# EAGLE schematic zx80_build034.routed (EAGLE 7.5.0)

## Sheet 1 of 3
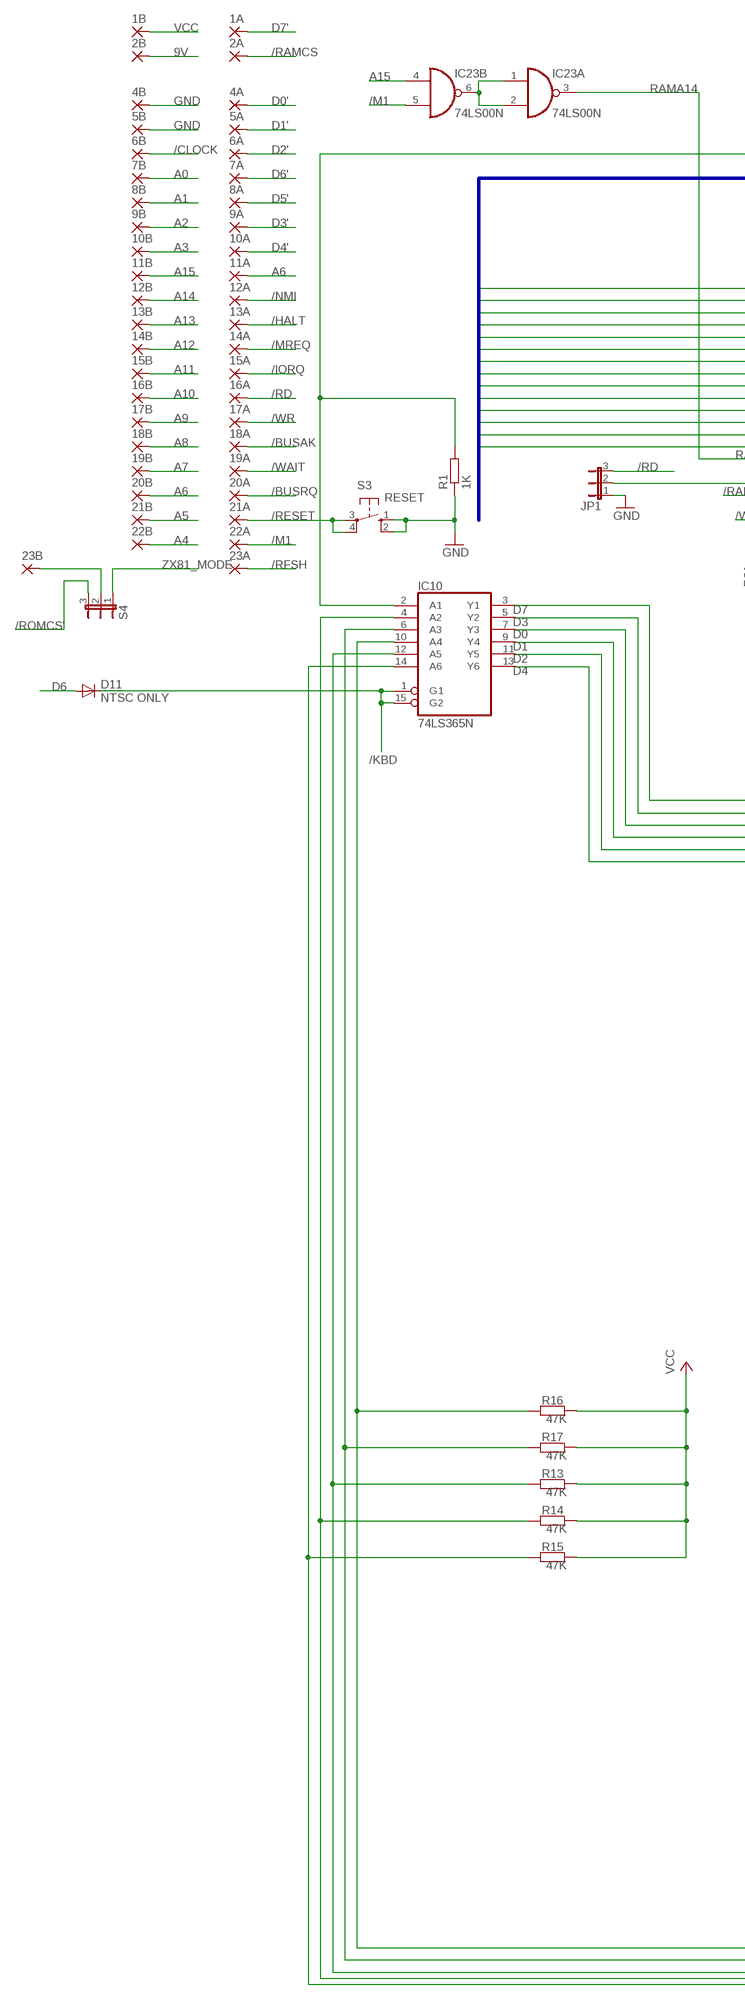
[diagram p0: schematic, sheet 1, part 1 of 2]
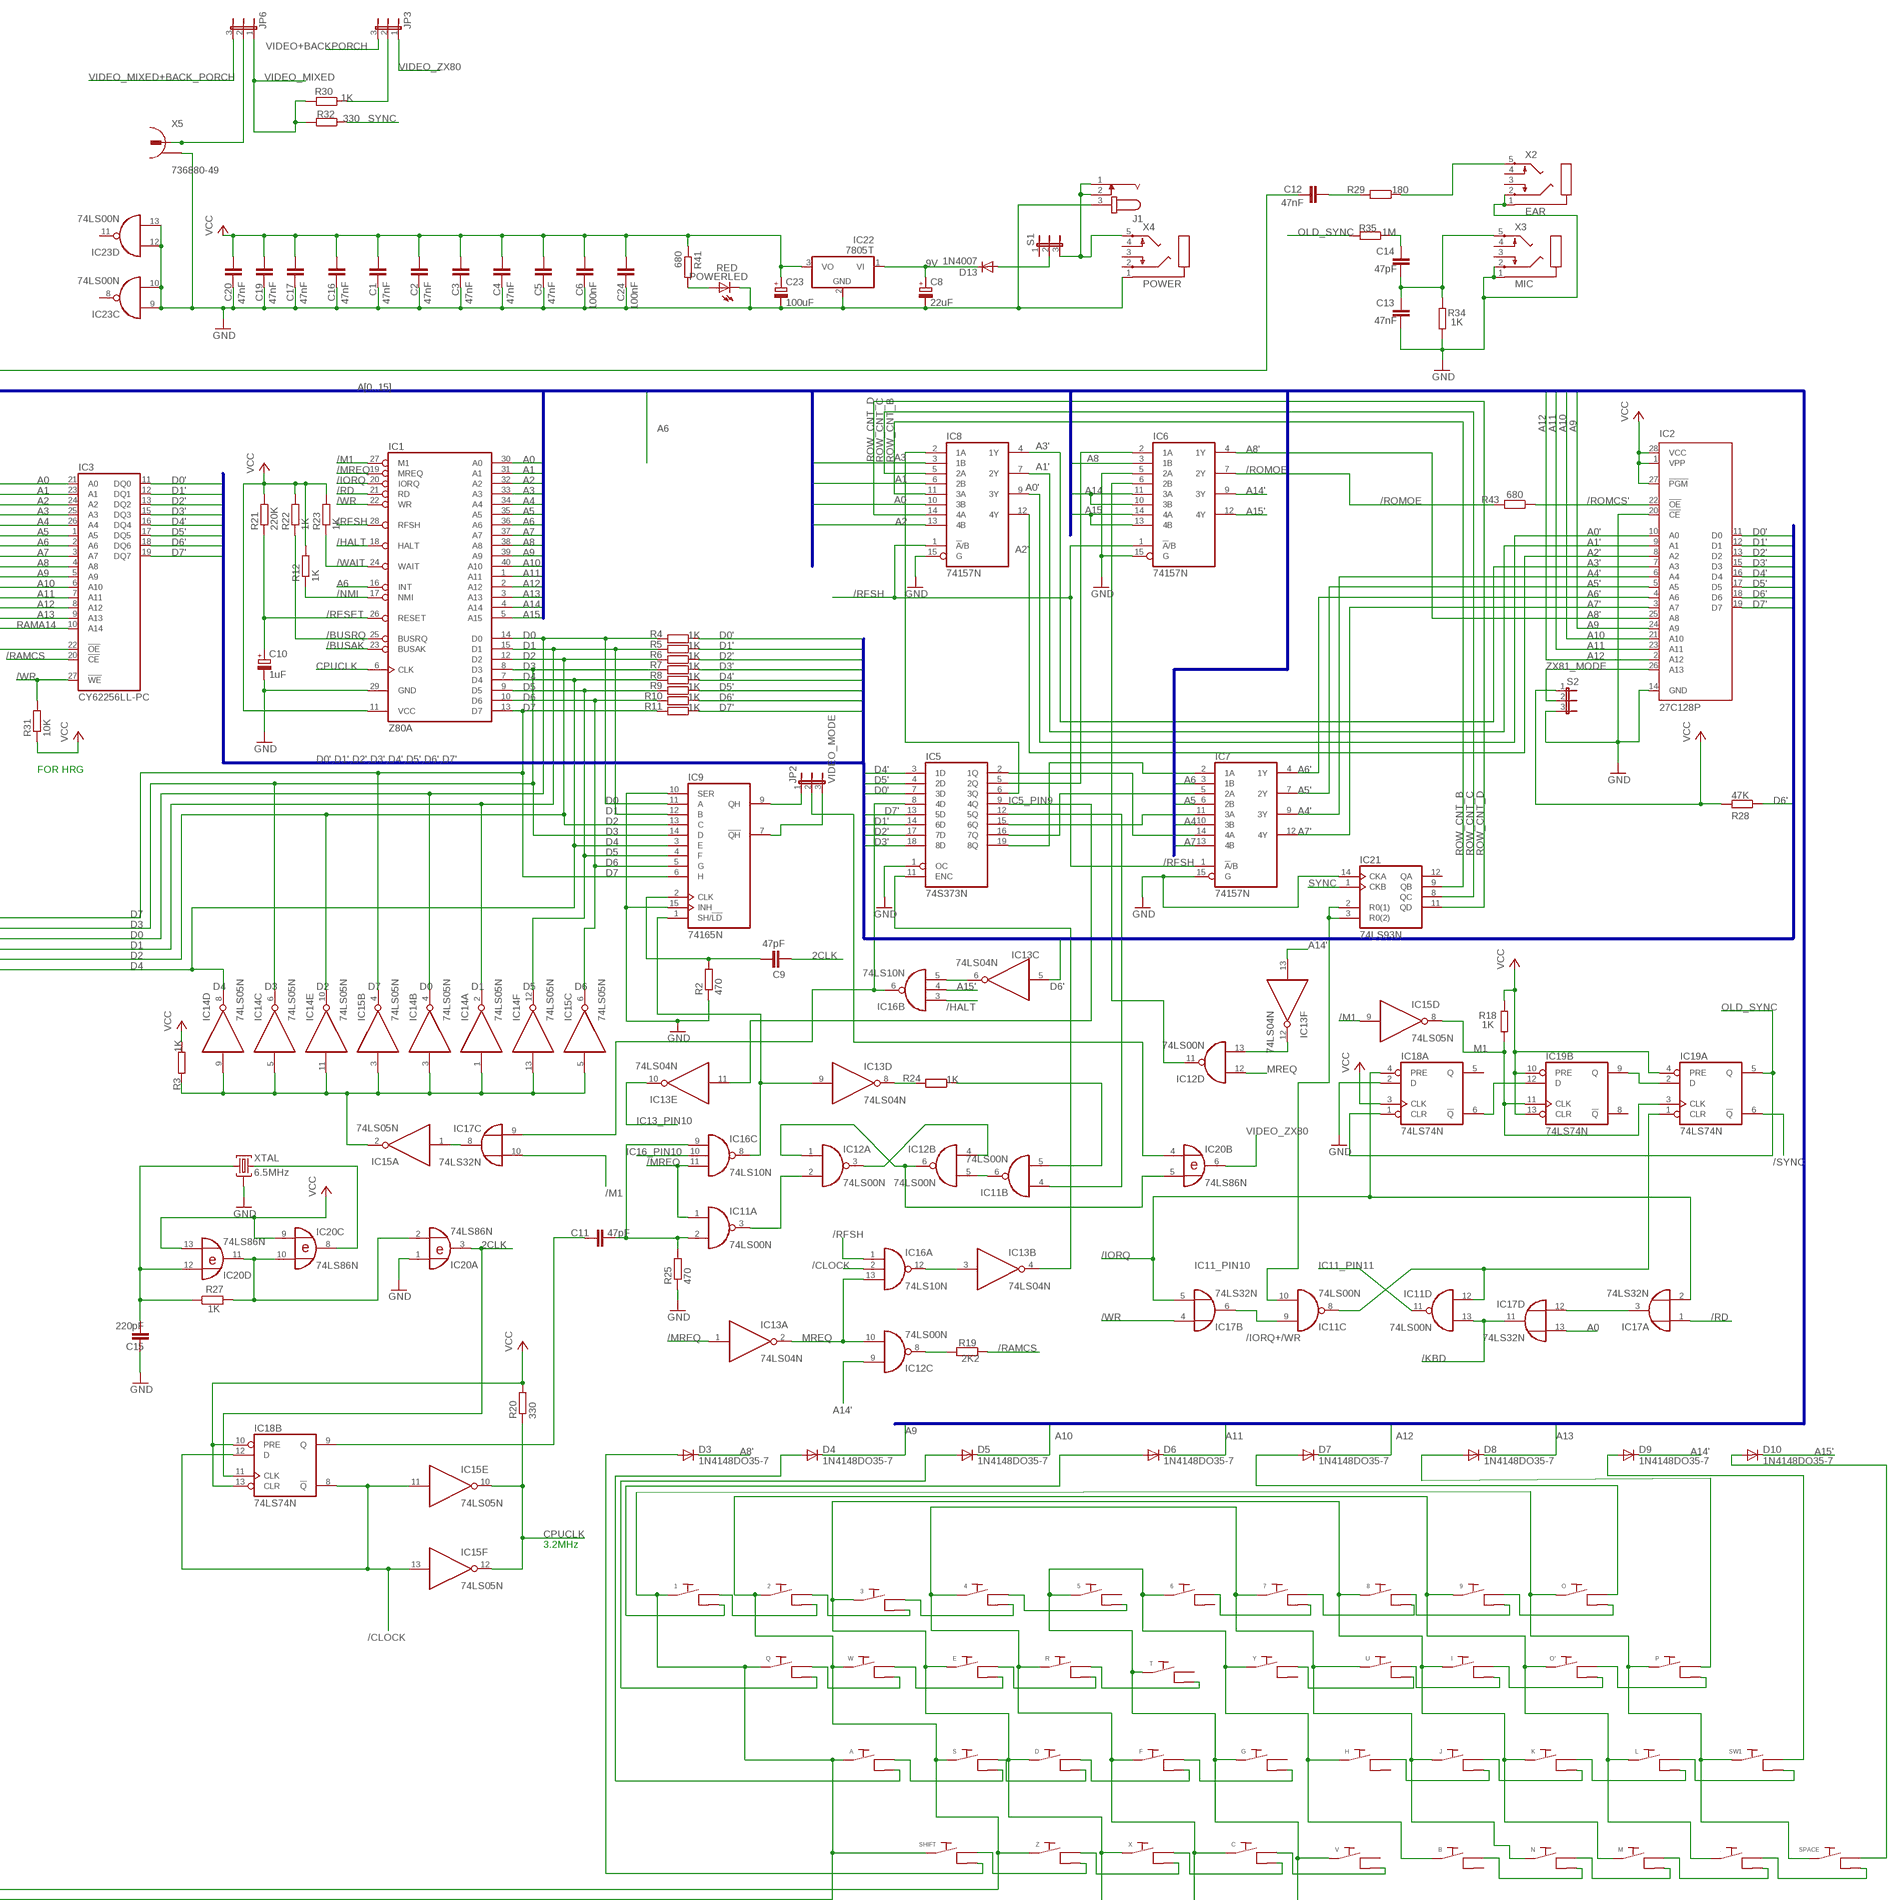
[diagram p1: schematic, sheet 1, part 2 of 2]

### Parts
1  TA_DK  [TA_DK]
1A  SMD2EDGEPIN  [EDGEPIN]
1B  SMD2EDGEPIN  [EDGEPIN]
2  TA_DK  [TA_DK]
2A  SMD2EDGEPIN  [EDGEPIN]
2B  SMD2EDGEPIN  [EDGEPIN]
3  TA_DK  [TA_DK]
4  TA_DK  [TA_DK]
4A  SMD2EDGEPIN  [EDGEPIN]
4B  SMD2EDGEPIN  [EDGEPIN]
5  TA_DK  [TA_DK]
5A  SMD2EDGEPIN  [EDGEPIN]
5B  SMD2EDGEPIN  [EDGEPIN]
6  TA_DK  [TA_DK]
6A  SMD2EDGEPIN  [EDGEPIN]
6B  SMD2EDGEPIN  [EDGEPIN]
7  TA_DK  [TA_DK]
7A  SMD2EDGEPIN  [EDGEPIN]
7B  SMD2EDGEPIN  [EDGEPIN]
8  TA_DK  [TA_DK]
8A  SMD2EDGEPIN  [EDGEPIN]
8B  SMD2EDGEPIN  [EDGEPIN]
9  TA_DK  [TA_DK]
9A  SMD2EDGEPIN  [EDGEPIN]
9B  SMD2EDGEPIN  [EDGEPIN]
10A  SMD2EDGEPIN  [EDGEPIN]
10B  SMD2EDGEPIN  [EDGEPIN]
11A  SMD2EDGEPIN  [EDGEPIN]
11B  SMD2EDGEPIN  [EDGEPIN]
12A  SMD2EDGEPIN  [EDGEPIN]
12B  SMD2EDGEPIN  [EDGEPIN]
13A  SMD2EDGEPIN  [EDGEPIN]
13B  SMD2EDGEPIN  [EDGEPIN]
14A  SMD2EDGEPIN  [EDGEPIN]
14B  SMD2EDGEPIN  [EDGEPIN]
15A  SMD2EDGEPIN  [EDGEPIN]
15B  SMD2EDGEPIN  [EDGEPIN]
16A  SMD2EDGEPIN  [EDGEPIN]
16B  SMD2EDGEPIN  [EDGEPIN]
17A  SMD2EDGEPIN  [EDGEPIN]
17B  SMD2EDGEPIN  [EDGEPIN]
18A  SMD2EDGEPIN  [EDGEPIN]
18B  SMD2EDGEPIN  [EDGEPIN]
19A  SMD2EDGEPIN  [EDGEPIN]
19B  SMD2EDGEPIN  [EDGEPIN]
20A  SMD2EDGEPIN  [EDGEPIN]
20B  SMD2EDGEPIN  [EDGEPIN]
21A  SMD2EDGEPIN  [EDGEPIN]
21B  SMD2EDGEPIN  [EDGEPIN]
22A  SMD2EDGEPIN  [EDGEPIN]
22B  SMD2EDGEPIN  [EDGEPIN]
23A  SMD2EDGEPIN  [EDGEPIN]
23B  SMD2EDGEPIN  [EDGEPIN]
.  TA_DK  [TA_DK]
A  TA_DK  [TA_DK]
B  TA_DK  [TA_DK]
C  TA_DK  [TA_DK]
C1  47nF  C-EU025-024X044  [C025-024X044]
C2  47nF  C-EU025-024X044  [C025-024X044]
C3  47nF  C-EU025-024X044  [C025-024X044]
C4  47nF  C-EU025-024X044  [C025-024X044]
C5  47nF  C-EU025-024X044  [C025-024X044]
C6  100nF  C-EU025-024X044  [C025-024X044]
C8  22uF  CPOL-EUE2.5-5  [E2,5-5]
C9  47pF  C-EU050-024X044  [C050-024X044]
C10  1uF  CPOL-EUE2.5-5  [E2,5-5]
C11  47pF  C-EU025-024X044  [C025-024X044]
C12  47nF  C-EU025-024X044  [C025-024X044]
C13  47nF  C-EU025-024X044  [C025-024X044]
C14  47pF  C-EU025-024X044  [C025-024X044]
C15  220pF  C-EU025-024X044  [C025-024X044]
C16  47nF  C-EU025-024X044  [C025-024X044]
C17  47nF  C-EU025-024X044  [C025-024X044]
C19  47nF  C-EU025-024X044  [C025-024X044]
C20  47nF  C-EU025-024X044  [C025-024X044]
C23  100uF  CPOL-EUE2.5-5  [E2,5-5]
C24  100nF  C-EU050-025X075  [C050-025X075]
D  TA_DK  [TA_DK]
D3  1N4148DO35-7  [DO35-7]
D4  1N4148DO35-7  [DO35-7]
D5  1N4148DO35-7  [DO35-7]
D6  1N4148DO35-7  [DO35-7]
D7  1N4148DO35-7  [DO35-7]
D8  1N4148DO35-7  [DO35-7]
D9  1N4148DO35-7  [DO35-7]
D10  1N4148DO35-7  [DO35-7]
D11  NTSC ONLY  1N4148DO35-7  [DO35-7]
D13  1N4007  1N4942  [DO41-10]
E  TA_DK  [TA_DK]
F  TA_DK  [TA_DK]
G  TA_DK  [TA_DK]
H  TA_DK  [TA_DK]
I  TA_DK  [TA_DK]
IC1  Z80A  Z80CPU  [DIL40]
IC2  27C128P  [DIL28-6]
IC3  CY62256LL-PC  [DIL28-6]
IC5  74S373N  [DIL20]
IC6  74157N  [DIL16]
IC7  74157N  [DIL16]
IC8  74157N  [DIL16]
IC9  74165N  [DIL16]
IC10  74LS365N  [DIL16]
IC11  74LS00N  [DIL14]
IC12  74LS00N  [DIL14]
IC13  74LS04N  [DIL14]
IC14  74LS05N  [DIL14]
IC15  74LS05N  [DIL14]
IC16  74LS10N  [DIL14]
IC17  74LS32N  [DIL14]
IC18  74LS74N  [DIL14]
IC19  74LS74N  [DIL14]
IC20  74LS86N  [DIL14]
IC21  74LS93N  [DIL14]
IC22  7805T  [TO220H]
IC23  74LS00N  [DIL14]
J  TA_DK  [TA_DK]
J1  JACK-PLUG0  [SPC4077]
JP1  JP2E  [JP2]
JP2  VIDEO_MODE  JP2E  [JP2]
JP3  JP2E  [JP2]
JP6  JP2E  [JP2]
K  TA_DK  [TA_DK]
L  TA_DK  [TA_DK]
M  TA_DK  [TA_DK]
N  TA_DK  [TA_DK]
O  TA_DK  [TA_DK]
O'  TA_DK  [TA_DK]
P  TA_DK  [TA_DK]
POWERLED  RED  LED3MM  [LED3MM]
Q  TA_DK  [TA_DK]
R  TA_DK  [TA_DK]
R1  1K  R-EU_0204/7  [0204/7]
R2  470  R-EU_0204/7  [0204/7]
R3  1K  R-EU_0204/7  [0204/7]
R4  1K  R-EU_0204/7  [0204/7]
R5  1K  R-EU_0204/7  [0204/7]
R6  1K  R-EU_0204/7  [0204/7]
R7  1K  R-EU_0204/7  [0204/7]
R8  1K  R-EU_0204/7  [0204/7]
R9  1K  R-EU_0204/7  [0204/7]
R10  1K  R-EU_0204/7  [0204/7]
R11  1K  R-EU_0204/7  [0204/7]
R12  1K  R-EU_0204/7  [0204/7]
R13  47K  R-EU_0204/7  [0204/7]
R14  47K  R-EU_0204/7  [0204/7]
R15  47K  R-EU_0204/7  [0204/7]
R16  47K  R-EU_0204/7  [0204/7]
R17  47K  R-EU_0204/7  [0204/7]
R18  1K  R-EU_0204/7  [0204/7]
R19  2K2  R-EU_0204/7  [0204/7]
R20  330  R-EU_0204/7  [0204/7]
R21  220K  R-EU_0204/7  [0204/7]
R22  1K  R-EU_0204/7  [0204/7]
R23  1K  R-EU_0204/7  [0204/7]
R24  1K  R-EU_0204/7  [0204/7]
R25  470  R-EU_0204/7  [0204/7]
R27  1K  R-EU_0204/7  [0204/7]
R28  47K  R-EU_0204/7  [0204/7]
R29  180  R-EU_0204/7  [0204/7]
R30  1K  R-EU_0204/7  [0204/7]
R31  10K  R-EU_0204/7  [0204/7]
R32  330  R-EU_0204/7  [0204/7]
R34  1K  R-EU_0204/7  [0204/7]
R35  1M  R-EU_0204/7  [0204/7]
R41  680  R-EU_0204/7  [0204/7]
R43  680  R-EU_0204/7  [0204/7]
S  TA_DK  [TA_DK]
S1  JP2E  [JP2]
S2  JP2E  [JP2]
S3  RESET  10-XX  [B3F-10XX]
S4  JP2E  [JP2]
SHIFT  TA_DK  [TA_DK]
SPACE  TA_DK  [TA_DK]
SW1  TA_DK  [TA_DK]
T  TA_DK  [TA_DK]
U  TA_DK  [TA_DK]
V  TA_DK  [TA_DK]
W  TA_DK  [TA_DK]
X  TA_DK  [TA_DK]
X2  EAR  PG203J  [PG203J]
X3  MIC  PG203J  [PG203J]
X4  POWER  PG203J  [PG203J]
X5  736880-49  [736880-49]
XTAL  6.5MHz  8M10AHC49T  [HC49U]
Y  TA_DK  [TA_DK]
Z  TA_DK  [TA_DK]

### Nets
2CLK: C9.2 IC18.11(B:CLK) IC20.3(A:O)
9V [VCC]: 2B.1(P) C8.+ D13.C IC22.1(VI)
/BUSAK: 18A.1(P) IC1.23(BUSAK)
/BUSRQ: 20A.1(P) IC1.25(BUSRQ) R22.1
/CLOCK: 6B.1(P) IC15.11(E:I) IC15.13(F:I) IC16.2(A:I1) IC18.8(B:!Q) IC18.12(B:D) ; also sheet 2
/HALT: 13A.1(P) IC1.18(HALT) IC16.3(B:I0) ; also sheet 2
/IORQ: 15A.1(P) IC1.20(IORQ) IC17.2(A:I1) IC17.5(B:I1) IC18.4(A:PRE) ; also sheet 2
/IORQ+/WR: IC11.9(C:I0) IC17.6(B:O) ; also sheet 2
/KBD: D11.C IC10.1(G1) IC10.15(G2) IC11.13(D:I1) IC17.11(D:O)
/M1: 22A.1(P) IC1.27(M1) IC15.9(D:I) IC17.10(C:I1) IC23.5(B:I1) ; also sheet 2
/MREQ: 14A.1(P) IC1.19(MREQ) IC11.1(A:I0) IC13.1(A:I) IC16.11(C:I2)
/NMI: 12A.1(P) IC1.17(NMI) R12.1 ; also sheet 2
/RAMCS: 2A.1(P) IC3.20(!CE) R19.1
/RD: 16A.1(P) IC1.21(RD) IC17.1(A:I0) JP1.3
/RESET: 21A.1(P) C10.+ IC1.26(RESET) R21.1 S3.3(P) S3.4(P1)
/RFSH: 23A.1(P) IC1.28(RFSH) IC6.1(!A!/B) IC7.1(!A!/B) IC8.1(!A!/B) IC16.1(A:I0)
/ROMCS': IC2.22(!OE) R43.1 S4.3
/ROMOE: IC6.7(2Y) R43.2
/SYNC: IC19.6(A:!Q)
/WAIT: 19A.1(P) IC1.24(WAIT) R23.1 ; also sheet 2
/WR: 17A.1(P) IC1.22(WR) IC3.27(!WE) IC17.4(B:I0) R31.2
A0: 7B.1(P) IC1.30(A0) IC3.21(A0) IC8.10(3B) IC17.13(D:I1) ; also sheet 2
A0': IC2.10(A0) IC8.9(3Y)
A1: 8B.1(P) IC1.31(A1) IC3.23(A1) IC8.6(2B) ; also sheet 2
A1': IC2.9(A1) IC8.7(2Y)
A2: 9B.1(P) IC1.32(A2) IC3.24(A2) IC8.13(4B)
A2': IC2.8(A2) IC8.12(4Y)
A3: 10B.1(P) IC1.33(A3) IC3.25(A3) IC8.3(1B)
A3': IC2.7(A3) IC8.4(1Y)
A4: 22B.1(P) IC1.34(A4) IC3.26(A4) IC7.10(3B)
A4': IC2.6(A4) IC7.9(3Y)
A5: 21B.1(P) IC1.35(A5) IC3.1(A5) IC7.6(2B)
A5': IC2.5(A5) IC7.7(2Y)
A6: 11A.1(P) 20B.1(P) IC1.16(INT) IC1.36(A6) IC3.2(A6) IC7.3(1B)
A6': IC2.4(A6) IC7.4(1Y)
A7: 19B.1(P) IC1.37(A7) IC3.3(A7) IC7.13(4B)
A7': IC2.3(A7) IC7.12(4Y)
A8: 18B.1(P) IC1.38(A8) IC3.4(A8) IC6.3(1B)
A8': D3.C IC2.25(A8) IC6.4(1Y)
A9: 17B.1(P) D4.C IC1.39(A9) IC2.24(A9) IC3.5(A9)
A10: 16B.1(P) D5.C IC1.40(A10) IC2.21(A10) IC3.6(A10)
A11: 15B.1(P) D6.C IC1.1(A11) IC2.23(A11) IC3.7(A11)
A12: 14B.1(P) D7.C IC1.2(A12) IC2.2(A12) IC3.8(A12)
A13: 13B.1(P) D8.C IC1.3(A13) IC3.9(A13)
A14: 12B.1(P) IC1.4(A14) IC6.10(3B) IC6.11(3A)
A14': D9.C IC6.9(3Y) IC12.9(C:I0) IC13.13(F:I)
A15: 11B.1(P) IC1.5(A15) IC6.13(4B) IC6.14(4A) IC23.4(B:I0)
A15': D10.C IC6.12(4Y) IC16.4(B:I1)
CPUCLK: IC1.6(CLK) IC15.10(E:O) IC15.12(F:O) R20.1
D0: IC1.14(D0) IC9.11(A) IC10.7(Y3) IC14.4(B:O) R4.2
D0': 4A.1(P) IC2.11(D0) IC3.11(DQ0) IC5.7(3D) R4.1
D1: IC1.15(D1) IC9.12(B) IC10.9(Y4) IC14.2(A:O) R5.2
D1': 5A.1(P) IC2.12(D1) IC3.12(DQ1) IC5.14(6D) R5.1
D2: IC1.12(D2) IC9.13(C) IC10.11(Y5) IC14.10(E:O) R6.2
D2': 6A.1(P) IC2.13(D2) IC3.13(DQ2) IC5.17(7D) R6.1
D3: IC1.8(D3) IC9.14(D) IC10.5(Y2) IC14.6(C:O) R7.2
D3': 9A.1(P) IC2.15(D3) IC3.15(DQ3) IC5.18(8D) R7.1
D4: IC1.7(D4) IC9.3(E) IC10.13(Y6) IC14.8(D:O) R8.2
D4': 10A.1(P) IC2.16(D4) IC3.16(DQ4) IC5.3(1D) R8.1
D5: IC1.9(D5) IC9.4(F) IC14.12(F:O) R9.2
D5': 8A.1(P) IC2.17(D5) IC3.17(DQ5) IC5.4(2D) R9.1
D6: D11.A IC1.10(D6) IC9.5(G) IC15.6(C:O) R10.2
D6': 7A.1(P) IC2.18(D6) IC3.18(DQ6) IC13.5(C:I) R10.1 R28.1
D7: IC1.13(D7) IC9.6(H) IC10.3(Y1) IC15.4(B:O) R11.2
D7': 1A.1(P) IC2.19(D7) IC3.19(DQ7) IC5.13(5D) R11.1
FINAL_VIDEO: JP6.2 X5.2 X5.2@2
GND [VCC]: 4B.1(P) 5B.1(P) C1.2 C2.2 C3.2 C4.2 C5.2 C6.2 C8.- C10.- C13.2 C15.1 C16.2 C17.2 C19.2 C20.2 C23.- C24.2 IC1.29(GND) IC2.14(GND) IC2.20(!CE) IC5.1(OC) IC6.5(2A) IC6.15(G) IC7.15(G) IC8.15(G) IC9.10(SER) IC9.15(INH) IC18.2(A:D) IC20.1(A:I0) IC21.14(CKA) IC22.2(GND) IC23.9(C:I0) IC23.10(C:I1) IC23.12(D:I0) IC23.13(D:I1) J1.3 JP1.1 POWERLED.K(C) R1.1 R2.1 R25.1 R34.2 S2.3 S3.1(S) S3.2(S1) X2.1 X2.2 X3.1 X3.2 X4.1 X5.1 XTAL.2 ; also sheet 2,3
IC5_PIN9: IC5.9(4Q) IC13.11(E:I) ; also sheet 2
IC11_PIN10: IC11.10(C:I1) IC21.2(R0(1)) IC21.3(R0(2)) ; also sheet 2
IC11_PIN11: IC11.11(D:O) ; also sheet 2
IC12_PIN11: IC6.6(2B) IC12.11(D:O)
IC13_PIN10: IC13.10(E:O)
IC16_PIN10: IC16.10(C:I1) ; also sheet 2
M1: IC15.8(D:O) IC19.3(A:CLK) IC19.11(B:CLK) R18.2
MREQ: IC12.10(C:I1) IC12.12(D:I0) IC13.2(A:O) IC16.13(A:I2)
N$1: IC5.5(2Q) IC6.2(1A)
N$3 [VCC]: J1.1 J1.2 S1.3 X4.5
N$4: IC5.6(3Q) IC8.2(1A)
N$6: IC5.2(1Q) IC7.14(4A)
N$8: POWERLED.A R41.2
N$9: C9.1 IC9.2(CLK) R2.2
N$10: IC14.1(A:I) IC14.3(B:I) IC14.5(C:I) IC14.9(D:I) IC14.11(E:I) IC14.13(F:I) IC15.2(A:O) IC15.3(B:I) IC15.5(C:I) R3.2
N$12: IC3.22(!OE) JP1.2
N$13: D3.A SHIFT.2@8
N$14: 4.1 7.1 C.1 F.1 IC10.4(A2) J.1 N.1 R14.2 R.1 U.1
N$16: IC13.6(C:O) IC16.5(B:I2)
N$17: IC5.8(4D) IC16.6(B:O) IC17.9(C:I0)
N$18: R29.1 X2.5
N$19: IC15.1(A:I) IC17.8(C:O)
N$20: U.2@8 Y.2@1
N$22: C11.2 IC11.2(A:I1) IC16.9(C:I0) R25.2
N$23: IC9.1(SH/!LD) IC13.9(D:I) IC16.8(C:O)
N$24: D10.A SPACE.2@1
N$25: IC13.8(D:O) R24.2
N$26: C11.1 IC18.9(B:Q)
N$27: IC11.3(A:O) IC12.2(A:I1)
N$28: IC12.1(A:I0) IC12.6(B:O) IC20.5(B:I1)
N$29: IC12.3(A:O) IC12.4(B:I0)
N$30: IC11.6(B:O) IC12.5(B:I1)
N$31: IC11.5(B:I1) R24.1
N$32: IC5.12(5Q) IC11.4(B:I0)
N$33: IC9.9(QH) JP2.1
N$34: IC9.7(!QH) JP2.3
N$35: IC20.4(B:I0) JP2.2
N$36: IC12.13(D:I1) IC13.12(F:O)
N$37: IC18.6(A:!Q) IC19.12(B:D)
N$38: IC19.2(A:D) IC19.9(B:Q)
N$42: IC11.8(C:O) IC11.12(D:I0) IC19.1(A:CLR)
N$43: IC13.3(B:I) IC16.12(A:O)
N$44: IC17.3(A:O) IC17.12(D:I0)
N$45: IC5.11(ENC) IC13.4(B:O)
N$47: IC12.8(C:O) R19.2
N$49: IC20.2(A:I1) IC20.10(C:I1) IC20.11(D:O) R27.2
N$50: C15.2 IC20.12(D:I0) R27.1 XTAL.1
N$51: IC20.8(C:O) XTAL.3
N$55: 5.1 6.1 B.1 G.1 H.1 IC10.14(A6) R15.2 T.1 V.1 Y.1
N$56: C12.2 IC10.2(A1) R1.2
N$57: C12.1 R29.2
N$58 [VCC]: D13.A S1.2
N$61: C13.1 C14.2 R34.1 X3.5
N$62: 3.1 8.1 D.1 E.1 I.1 IC10.12(A5) K.1 M.1 R13.2 X.1
N$63: C14.1 R35.1
N$64: 1.2@1 2.2@8
N$65: 23B.1(P) S4.2
N$67: D7.A O.2@1
N$70: 2.2@1 3.2@8
N$71: Q.2@1 W.2@8
N$72: E.2@8 W.2@1
N$73: K.2@1 L.2@8
N$76: I.2@1 O'.2@8
N$79: C.2@8 X.2@1
N$80: C.2@1 V.2@8
N$81: J.2@1 K.2@8
N$84: D8.A P.2@1
N$87: H.2@1 J.2@8
N$88: A.2@1 S.2@8
N$89: I.2@8 U.2@1
N$93: D9.A SW1.2@1
N$94: L.2@1 SW1.2@8
N$95: O'.2@1 P.2@8
N$96: 9.2@1 O.2@8
N$97: X.2@8 Z.2@1
N$112: JP3.2 R30.1
N$118: ..2@1 SPACE.2@8
N$120: ..2@8 M.2@1
N$121: M.2@8 N.2@1
N$122: B.2@1 N.2@8
N$124: D.2@8 S.2@1
N$125: SHIFT.2@1 Z.2@8
N$126: D.2@1 F.2@8
N$127: F.2@1 G.2@8
N$128: E.2@1 R.2@8
N$129: A.2@8 D4.A
N$130: D5.A Q.2@8
N$131: 1.2@8 D6.A
N$132: R.2@1 T.2@8
N$133: 2.1 9.1 ..1 IC10.10(A4) L.1 O'.1 R16.2 S.1 W.1 Z.1
N$135: 3.2@1 4.2@8
N$136: 4.2@1 5.2@8
N$137: 1.1 A.1 IC10.6(A3) O.1 P.1 Q.1 R17.2 SHIFT.1 SPACE.1 SW1.1
N$138: IC5.15(6Q) IC7.11(3A)
N$139: IC5.16(7Q) IC7.5(2A)
N$140: IC5.19(8Q) IC7.2(1A)
N$141: IC23.1(A:I0) IC23.2(A:I1) IC23.6(B:O)
N$142: 6.2@1 7.2@8
N$143: 7.2@1 8.2@8
N$144: 8.2@1 9.2@8
OLD_SYNC: IC18.1(A:CLR) IC19.5(A:Q) R35.2
RAMA14: IC3.10(A14) IC23.3(A:O)
ROW_CNT_B: IC8.11(3A) IC21.9(QB)
ROW_CNT_C: IC8.5(2A) IC21.8(QC)
ROW_CNT_D: IC8.14(4A) IC21.11(QD)
SYNC: IC21.1(CKB) R32.1 ; also sheet 2
VCC [VCC]: 1B.1(P) C1.1 C2.1 C3.1 C4.1 C5.1 C6.1 C16.1 C17.1 C19.1 C20.1 C23.+ C24.1 IC1.11(VCC) IC2.1(VPP) IC2.27(!PGM) IC2.28(VCC) IC18.3(A:CLK) IC18.10(B:PRE) IC18.13(B:CLR) IC19.4(A:PRE) IC19.10(B:PRE) IC19.13(B:CLR) IC20.9(C:I0) IC20.13(D:I1) IC22.3(VO) R3.1 R12.2 R13.1 R14.1 R15.1 R16.1 R17.1 R18.1 R20.2 R21.2 R22.2 R23.2 R28.2 R31.1 R41.1 S2.1 ; also sheet 2,3
VIDEO+BACKPORCH: JP3.3 ; also sheet 2
VIDEO_MIXED: JP6.1 R30.2 R32.2 ; also sheet 3
VIDEO_MIXED+BACK_PORCH: JP6.3 ; also sheet 3
VIDEO_ZX80: IC20.6(B:O) JP3.1 ; also sheet 2
ZX81_MODE: IC2.26(A13) S2.2 S4.1 ; also sheet 2
Unconnected: 5.2@1 6.2@8 B.2@8 G.2@1 H.2@8 IC18.5(A:Q) IC19.8(B:!Q) IC21.12(QA) IC23.8(C:O) IC23.11(D:O) S1.1 T.2@1 V.2@1 X2.3 X2.4 X3.3 X3.4 X4.2 X4.3 X4.4 Y.2@8

### Buses
A[0..15]
D0',D1',D2',D3',D4',D5',D6',D7'

### Notes on the sheet
- FOR HRG
- 3.2MHz

## Sheet 2 of 3
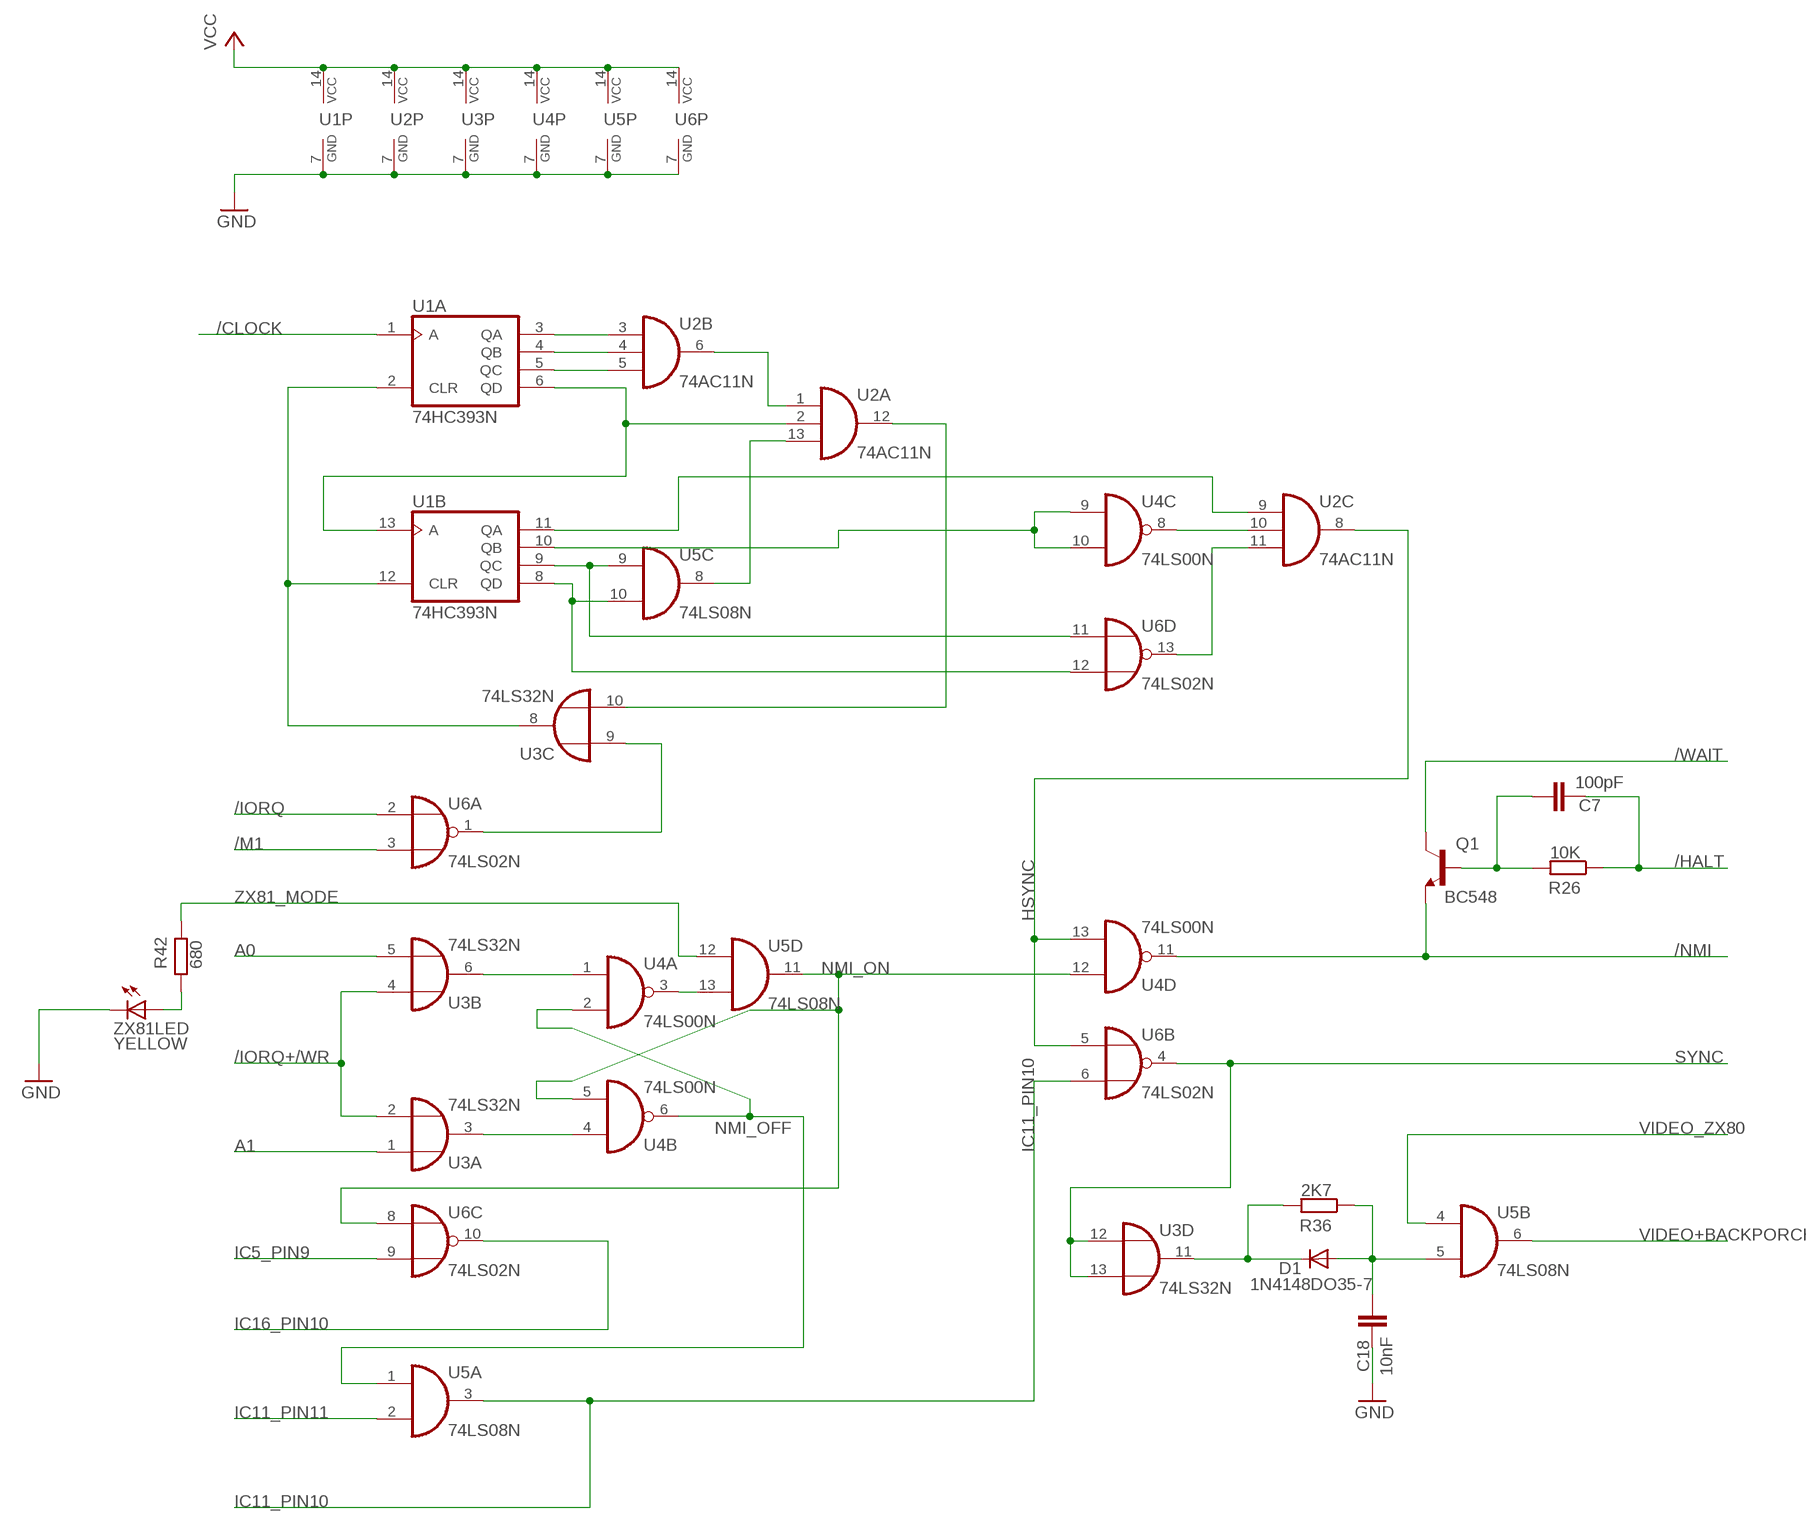
[diagram p2: schematic, sheet 2]

### Parts
C7  100pF  C-EU025-024X044  [C025-024X044]
C18  10nF  C-EU025-024X044  [C025-024X044]
D1  1N4148DO35-7  [DO35-7]
Q1  BC548  [TO92-EBC]
R26  10K  R-EU_0204/7  [0204/7]
R36  2K7  R-EU_0204/7  [0204/7]
R42  680  R-EU_0204/7  [0204/7]
U1  74HC393N  [DIL14]
U2  74AC11N  [DIL14]
U3  74LS32N  [DIL14]
U4  74LS00N  [DIL14]
U5  74LS08N  [DIL14]
U6  74LS02N  [DIL14]
ZX81LED  YELLOW  LED3MM  [LED3MM]

### Nets
/CLOCK: U1.1(A:A) ; also sheet 1
/HALT: C7.2 R26.1 ; also sheet 1
/IORQ: U6.2(A:I0) ; also sheet 1
/IORQ+/WR: U3.2(A:I1) U3.4(B:I0) ; also sheet 1
/M1: U6.3(A:I1) ; also sheet 1
/NMI: Q1.E U4.11(D:O) ; also sheet 1
/WAIT: Q1.C ; also sheet 1
A0: U3.5(B:I1) ; also sheet 1
A1: U3.1(A:I0) ; also sheet 1
GND [VCC]: C18.2 U1.7(P:GND) U2.7(P:GND) U3.7(P:GND) U4.7(P:GND) U5.7(P:GND) U6.7(P:GND) ZX81LED.K(C) ; also sheet 1,3
HSYNC: U2.8(C:O) U4.13(D:I1) U6.5(B:I0)
IC5_PIN9: U6.9(C:I1) ; also sheet 1
IC11_PIN10: U5.3(A:O) U6.6(B:I1) ; also sheet 1
IC11_PIN11: U5.2(A:I1) ; also sheet 1
IC16_PIN10: U6.10(C:O) ; also sheet 1
N$5: U3.9(C:I0) U6.1(A:O)
N$7: C7.1 Q1.B R26.2
N$11: U1.3(A:QA) U2.3(B:I0)
N$40: U1.4(A:QB) U2.4(B:I1)
N$41: U1.5(A:QC) U2.5(B:I2)
N$53: U2.1(A:I0) U2.6(B:O)
N$54: U1.6(A:QD) U1.13(B:A) U2.2(A:I1)
N$60: U1.8(B:QD) U5.10(C:I1) U6.12(D:I1)
N$98: U1.10(B:QB) U4.9(C:I0) U4.10(C:I1)
N$99: U2.13(A:I2) U5.8(C:O)
N$100: U2.12(A:O) U3.10(C:I1)
N$101: U1.9(B:QC) U5.9(C:I0) U6.11(D:I0)
N$102: U1.11(B:QA) U2.9(C:I0)
N$103: U1.2(A:CLR) U1.12(B:CLR) U3.8(C:O)
N$104: U2.10(C:I1) U4.8(C:O)
N$105: U2.11(C:I2) U6.13(D:O)
N$106: D1.C R36.2 U3.11(D:O)
N$107: C18.1 D1.A R36.1 U5.5(B:I1)
N$108: R42.1 ZX81LED.A
N$109: U3.6(B:O) U4.1(A:I0)
N$110: U3.3(A:O) U4.4(B:I0)
N$111: U4.3(A:O) U5.13(D:I1)
NMI_OFF: U4.2(A:I1) U4.6(B:O) U5.1(A:I0)
NMI_ON: U4.5(B:I1) U4.12(D:I0) U5.11(D:O) U6.8(C:I0)
SYNC: U3.12(D:I0) U3.13(D:I1) U6.4(B:O) ; also sheet 1
VCC [VCC]: U1.14(P:VCC) U2.14(P:VCC) U3.14(P:VCC) U4.14(P:VCC) U5.14(P:VCC) U6.14(P:VCC) ; also sheet 1,3
VIDEO+BACKPORCH: U5.6(B:O) ; also sheet 1
VIDEO_ZX80: U5.4(B:I0) ; also sheet 1
ZX81_MODE: R42.2 U5.12(D:I0) ; also sheet 1

## Sheet 3 of 3
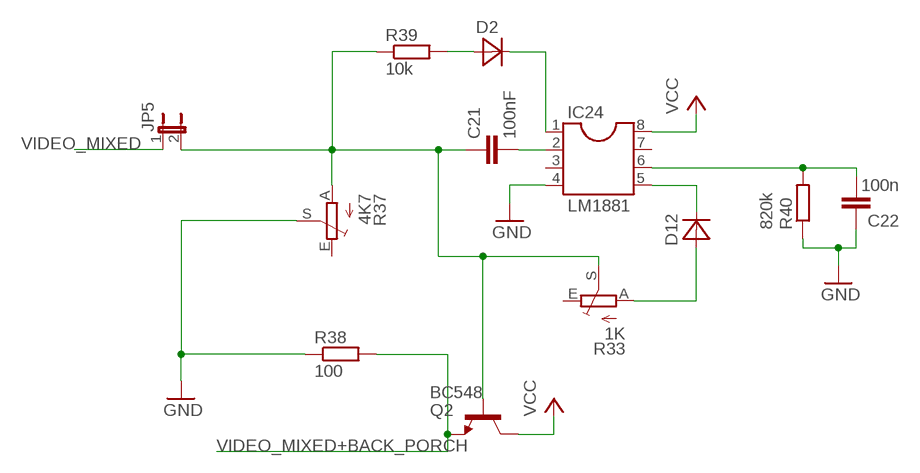
[diagram p3: schematic, sheet 3]

### Parts
C21  100nF  C-EU025-024X044  [C025-024X044]
C22  100n  C-EU025-024X044  [C025-024X044]
D2  DIODE-7,5  [D-7,5]
D12  DIODE-10/2  [D-10/2]
IC24  LM1881  DIL8  [DIL08]
JP5  JP1E  [JP1]
Q2  BC548  [TO92-EBC]
R33  1K  TRIM_EU-B25P  [B25P]
R37  4K7  TRIM_EU-B25P  [B25P]
R38  100  R-EU_0207/7  [0207/7]
R39  10k  R-EU_0207/7  [0207/7]
R40  820k  R-EU_0207/7  [0207/7]

### Nets
GND [VCC]: C22.1 IC24.4 R37.S R38.1 R40.1 ; also sheet 1,2
N$15: C21.2 IC24.2
N$21: D12.P$4(K) IC24.5
N$39: D12.P$3(A) R33.A
N$46: C22.2 IC24.6 R40.2
N$48: D2.2(K) IC24.1
N$52: D2.1(A) R39.2
VCC [VCC]: IC24.8 Q2.C ; also sheet 1,2
VIDEO': C21.1 JP5.2 Q2.B R33.S R37.A R39.1
VIDEO_MIXED: JP5.1 ; also sheet 1
VIDEO_MIXED+BACK_PORCH: Q2.E R38.2 ; also sheet 1
Unconnected: IC24.3 IC24.7 R33.E R37.E

## Power pins joined to a net without a drawn wire
GND: IC3.14(GND) IC5.10(GND) IC6.8(GND) IC7.8(GND) IC8.8(GND) IC9.8(GND) IC10.8(GND) IC11.7(P:GND) IC12.7(P:GND) IC13.7(P:GND) IC14.7(P:GND) IC15.7(P:GND) IC16.7(P:GND) IC17.7(P:GND) IC18.7(P:GND) IC19.7(P:GND) IC20.7(P:GND) IC21.10(GND) IC23.7(P:GND)
VCC: IC3.28(VCC) IC5.20(VCC) IC6.16(VCC) IC7.16(VCC) IC8.16(VCC) IC9.16(VCC) IC10.16(VCC) IC11.14(P:VCC) IC12.14(P:VCC) IC13.14(P:VCC) IC14.14(P:VCC) IC15.14(P:VCC) IC16.14(P:VCC) IC17.14(P:VCC) IC18.14(P:VCC) IC19.14(P:VCC) IC20.14(P:VCC) IC21.5(VCC) IC23.14(P:VCC)

## Library data of the parts
1-9 . A B C D E F G H I J K L M N O O' P Q R S SHIFT SPACE SW1 T U V W X Y Z = dome-key:TA_DK: Switch through-hole / Taster durchkontaktiert
1A 1B 2A 2B 4A 4B 5A 5B 6A 6B 7A 7B 8A 8B 9A 9B 10A 10B 11A 11B 12A 12B 13A 13B 14A 14B 15A 15B 16A 16B 17A 17B 18A 18B 19A 19B 20A 20B 21A 21B 22A 22B 23A 23B = wirepad:SMD2: SMD PAD
C1-C7 C9 C11-C22 C24 = resistor:C-EU: CAPACITOR, European symbol
C8 C10 C23 = resistor:CPOL-EU: POLARIZED CAPACITOR, European symbol
D1 D3-D11 = diode:1N4148: DIODE high speed (Philips)
D2 = Discrete:DIODE-7,5
D12 = Discrete:DIODE-10/2
D13 = diode:1N4942: DIODE 1.0 A, 200 V, 150 ns
IC1 = zilog:Z80CPU: Z80 FAMILY DEVICE
IC2 = microchip:27*128: CMOS EPROM 128 K (16 K x 8); OC_FARNELL: unknown; OC_NEWARK: unknown
IC3 = memory-sram:CY62256LL-?*: 256K (32K x 8) CMOS-Static RAM Source: http://download.cypress.com.edgesuite.net/design_resources/datasheets/contents/cy62256_8.pdf
IC5 = 74xx-eu:74*373: Octal D type transparent LATCH, edge triggered
IC6-IC8 = 74xx-eu:74*157: Quadruple 2-line to 1-line data SELECTOR/MULTIPLEXER
IC9 = 74xx-eu:74*165: 8-bit parallel load SHIFT REGISTER
IC10 = 74xx-eu:74*365: Hex BUS DRIVER, 3-state
IC11 IC12 IC23 U4 = 74xx-eu:74*00: Quad 2-input NAND gate
IC13 = 74xx-eu:74*04: Hex INVERTER
IC14 IC15 = 74xx-eu:74*05: Hex INVERTER, open collector
IC16 = 74xx-eu:74*10: Triple 3-input NAND gate
IC17 U3 = 74xx-eu:74*32: Quad 2-input OR gate
IC18 IC19 = 74xx-eu:74*74: Dual D type positive edge triggered FLIP FLOP, preset and clear
IC20 = 74xx-eu:74*86: Quad 2-input EXCLUSIVE-OR (XOR) gate
IC21 = 74xx-eu:74*93: Decade, divide by twelve and binary COUNTER
IC22 = linear:78*: Positive VOLTAGE REGULATOR Source: http://cache.national.com/ds/LM/LM78L05.pdf http://www.fairchildsemi.com/ds/LM/LM7805.pdf
IC24 = dil:DIL8: SOCKET Dual In Line
J1 = con-jack:JACK-PLUG: DC POWER JACK Power Jack, DC, Right Angle, Through Hole, Rated 5A at 16VDC, PC Terminals Distributor: Farnell (www.Farnell.de) Drawing: 84N1161.pdf / 84N1162.pdf Manufacturer: SPC Technology (www.spctechnology.com) Type: SPC4077 / SPC 4078; OC_FARNELL: unknown; OC_NEWARK: unknown
JP1-JP3 JP6 S1 S2 S4 = jumper:JP2E: JUMPER
JP5 = jumper:JP1E: JUMPER
POWERLED ZX81LED = led:LED: LED OSRAM: - CHIPLED LG R971, LG N971, LY N971, LG Q971, LY Q971, LO R971, LY R971 LH N974, LH R974 LS Q976, LO Q976, LY Q976 LO Q996 - Hyper CHIPLED LW Q18S LB Q993, LB Q99A, LB R99A - SideLED LS A670, LO A670, LY A670, LG A670, LP A670 LB A673, LV A673, LT A673, LW A673 LH A674 LY A675 LS A676, LA A676, LO A676, LY A676, LW A676 LS A679, LY A679, LG A679 - Hyper Micro SIDELED® LS Y876, LA Y876, LO Y876, LY Y876 LT Y87S - SmartLED LW L88C, LW L88S LB L89C, LB L89S, LG L890 LS L89K, LO L89K, LY L89K LS L896, LA L896, LO L896, LY L896 - TOPLED LS T670, LO T670, LY T670, LG T670, LP T670 LSG T670, LSP T670, LSY T670, LOP T670, LYG T670 LG T671, LOG T671, LSG T671 LB T673, LV T673, LT T673, LW T673 LH T674 LS T676, LA T676, LO T676, LY T676, LB T676, LH T676, LSB T676, LW T676 LB T67C, LV T67C, LT T67C, LS T67K, LO T67K, LY T67K, LW E67C LS E67B, LA E67B, LO E67B, LY E67B, LB E67C, LV E67C, LT E67C LW T67C LS T679, LY T679, LG T679 LS T770, LO T770, LY T770, LG T770, LP T770 LB T773, LV T773, LT T773, LW T773 LH T774 LS E675, LA E675, LY E675, LS T675 LS T776, LA T776, LO T776, LY T776, LB T776 LHGB T686 LT T68C, LB T68C - Hyper Mini TOPLED® LB M676 - Mini TOPLED Santana® LG M470 LS M47K, LO M47K, LY M47K Source: http://www.osram.convergy.de LUXEON: - LUMILED® LXK2-PW12-R00, LXK2-PW12-S00, LXK2-PW14-U00, LXK2-PW14-V00 LXK2-PM12-R00, LXK2-PM12-S00, LXK2-PM14-U00 LXK2-PE12-Q00, LXK2-PE12-R00, LXK2-PE12-S00, LXK2-PE14-T00, LXK2-PE14-U00 LXK2-PB12-K00, LXK2-PB12-L00, LXK2-PB12-M00, LXK2-PB14-N00, LXK2-PB14-P00, LXK2-PB14-Q00 LXK2-PR12-L00, LXK2-PR12-M00, LXK2-PR14-Q00, LXK2-PR14-R00 LXK2-PD12-Q00, LXK2-PD12-R00, LXK2-PD12-S00 LXK2-PH12-R00, LXK2-PH12-S00 LXK2-PL12-P00, LXK2-PL12-Q00, LXK2-PL12-R00 Source: www.luxeon.com KINGBRIGHT: KA-3528ASYC Source: www.kingbright.com
Q1 Q2 = transistor-npn:BC548*: NPN Transistor
R1-R32 R34-R36 R41-R43 = resistor:R-EU_: RESISTOR, European symbol
R33 R37 = pot:TRIM_EU-: POTENTIOMETER
R38-R40 = rcl:R-EU_: RESISTOR, European symbol
S3 = switch-omron:10-XX: OMRON SWITCH; MPN: B3F-1000; OC_FARNELL: 176432; OC_NEWARK: 36M3542
U1 = 74xx-eu:74*393: Dual 4-bit decade and binary COUNTER
U2 = 74xx-eu:74*11: Triple 3-input AND gate
U5 = 74xx-eu:74*08: Quad 2-input AND gate
U6 = 74xx-eu:74*02: Quad 2-input NOR gate
X2-X4 = con-hirschmann:PG203J: MIC/HEADPHONE JACK KS-S stereo microphone/headphone jack PG203JN (Schukat); OC_FARNELL: unknown; OC_NEWARK: unknown
X5 = con-conrad:736880-49: Cinch Connector ( RCA Jack )
XTAL = crystal:8M10AHC49T: Monolithic Crystal Filters Source: www.vanlong.com; OC_FARNELL: unknown; OC_NEWARK: unknown

## Net classes
1 VCC: width 0.5 mm